# Altium schematic sheet ADC_REF.SchDoc
size A4
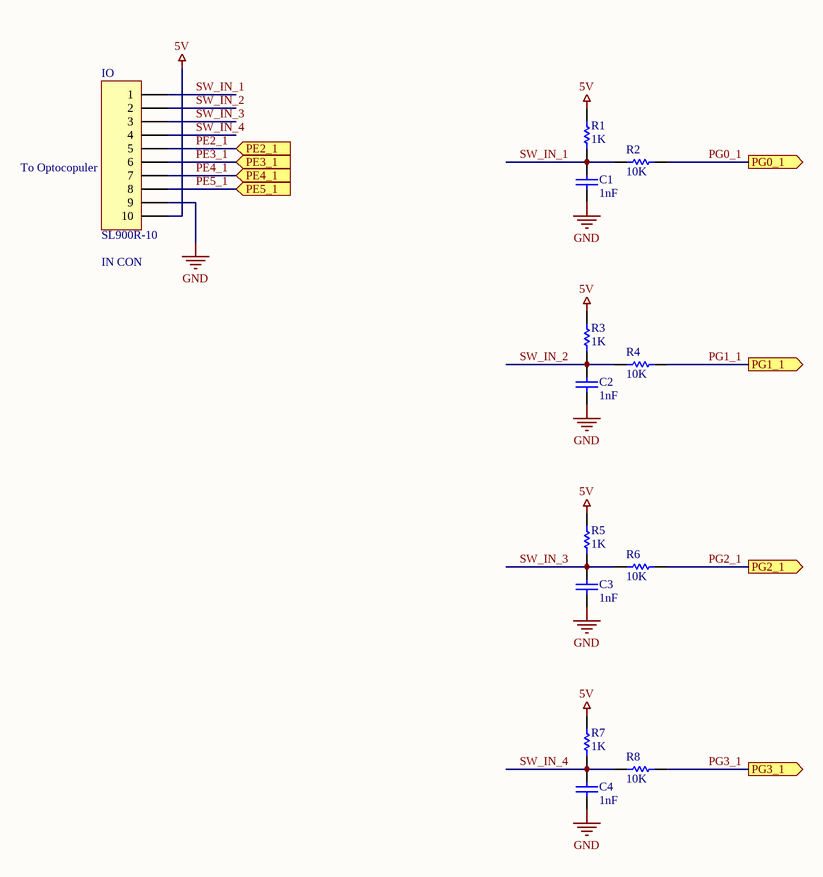
[diagram p0: ADC_REF.SchDoc]

## Parts
C1  1nF  [CAPC2013X140X50NL20T25]
C2  1nF  [CAPC2013X140X50NL20T25]
C3  1nF  [CAPC2013X140X50NL20T25]
C4  1nF  [CAPC2013X140X50NL20T25]
IO  SL900R-10  [SR-900R-10]
R1  1K  [RESC2113X50X35ML15T15]
R2  10K  [RESC2113X50X35ML15T15]
R3  1K  [RESC2113X50X35ML15T15]
R4  10K  [RESC2113X50X35ML15T15]
R5  1K  [RESC2113X50X35ML15T15]
R6  10K  [RESC2113X50X35ML15T15]
R7  1K  [RESC2113X50X35ML15T15]
R8  10K  [RESC2113X50X35ML15T15]

## Ports
PE2_1 (in), PE3_1 (in), PE4_1 (in), PE5_1 (in), PG0_1 (out), PG1_1 (out), PG2_1 (out), PG3_1 (out)

## Nets
5V: IO.10 R1.2 R3.2 R5.2 R7.2
GND: C1.1 C2.1 C3.1 C4.1 IO.9
PE2_1: IO.5 ; port PE2_1
PE3_1: IO.6 ; port PE3_1
PE4_1: IO.7 ; port PE4_1
PE5_1: IO.8 ; port PE5_1
PG0_1: R2.1 ; port PG0_1
PG1_1: R4.1 ; port PG1_1
PG2_1: R6.1 ; port PG2_1
PG3_1: R8.1 ; port PG3_1
SW_IN_1: C1.2 IO.1 R1.1 R2.2
SW_IN_2: C2.2 IO.2 R3.1 R4.2
SW_IN_3: C3.2 IO.3 R5.1 R6.2
SW_IN_4: C4.2 IO.4 R7.1 R8.2

## Notes on the sheet
- (near IO) To Optocopuler
- (near IO) IN CON
- Title
- Size:
- Date:
- A4
- Number:
- Time:
- Revision:
- Sheet
- of
- File:

## Library data of the parts
C1-C4 = CMP-2007-04527-1: Manufacturer: AVX Interconnect / Elco; Part Number: 08051A102JAT2A
IO = Header 10: Header, 10-Pin; LatestRevisionDate: 17-Jul-2002; LatestRevisionNote: Re-released for DXP Platform.; Publisher: Altium Limited
R1-R8 = CMP-2100-03615-1: Chip Resistor, 4.7 KOhm, +/- 1%, 0.125 W, -55 to 155 degC, 0805 (2012 Metric), RoHS, Tape and Reel; Manufacturer: Vishay Semiconductor; Temperature Coefficient: 100ppm/degreesC; Voltage Rating: 150V; Max Power Dissipation: 125mW; Packaging: TapeandReel; Max Operating Temperature: 155degC; Case Code (Imperial): 0805; Case/Package: 0805; Radiation Hardening: No; Package Reference: 0805; Lead Free: LeadFree; Package Description: 2-Pin Surface Mount Device, Body 2.05 x 1.25 mm; Manufacturer URL: http://www.vishay.com/; Tolerance: 1%; Height: 0.45mm; REACH SVHC: Unknown; Termination: SMD/SMT; Length: 2mm; Depth: 1.25mm; Case Code (Metric): 2012; Package Quantity: 10; Weight: 0.000194oz; Military Standard: Not; RoHSCompliant: true; Composition: ThickFilm; Contact Plating: Tin; Datasheet Version: 41061.0; Datasheet URL: https://datasheet.ciiva.com/11808/0900766b80d98b26-11808992.pdf; Width: 1.25mm; Number of Terminations: 2; Min Operating Temperature: -55degC; Power Rating: 125mW; Resistance: 4.7KOhm; Voltage Rating (DC): 150V